# EAGLE design working (EAGLE 9.6.0)
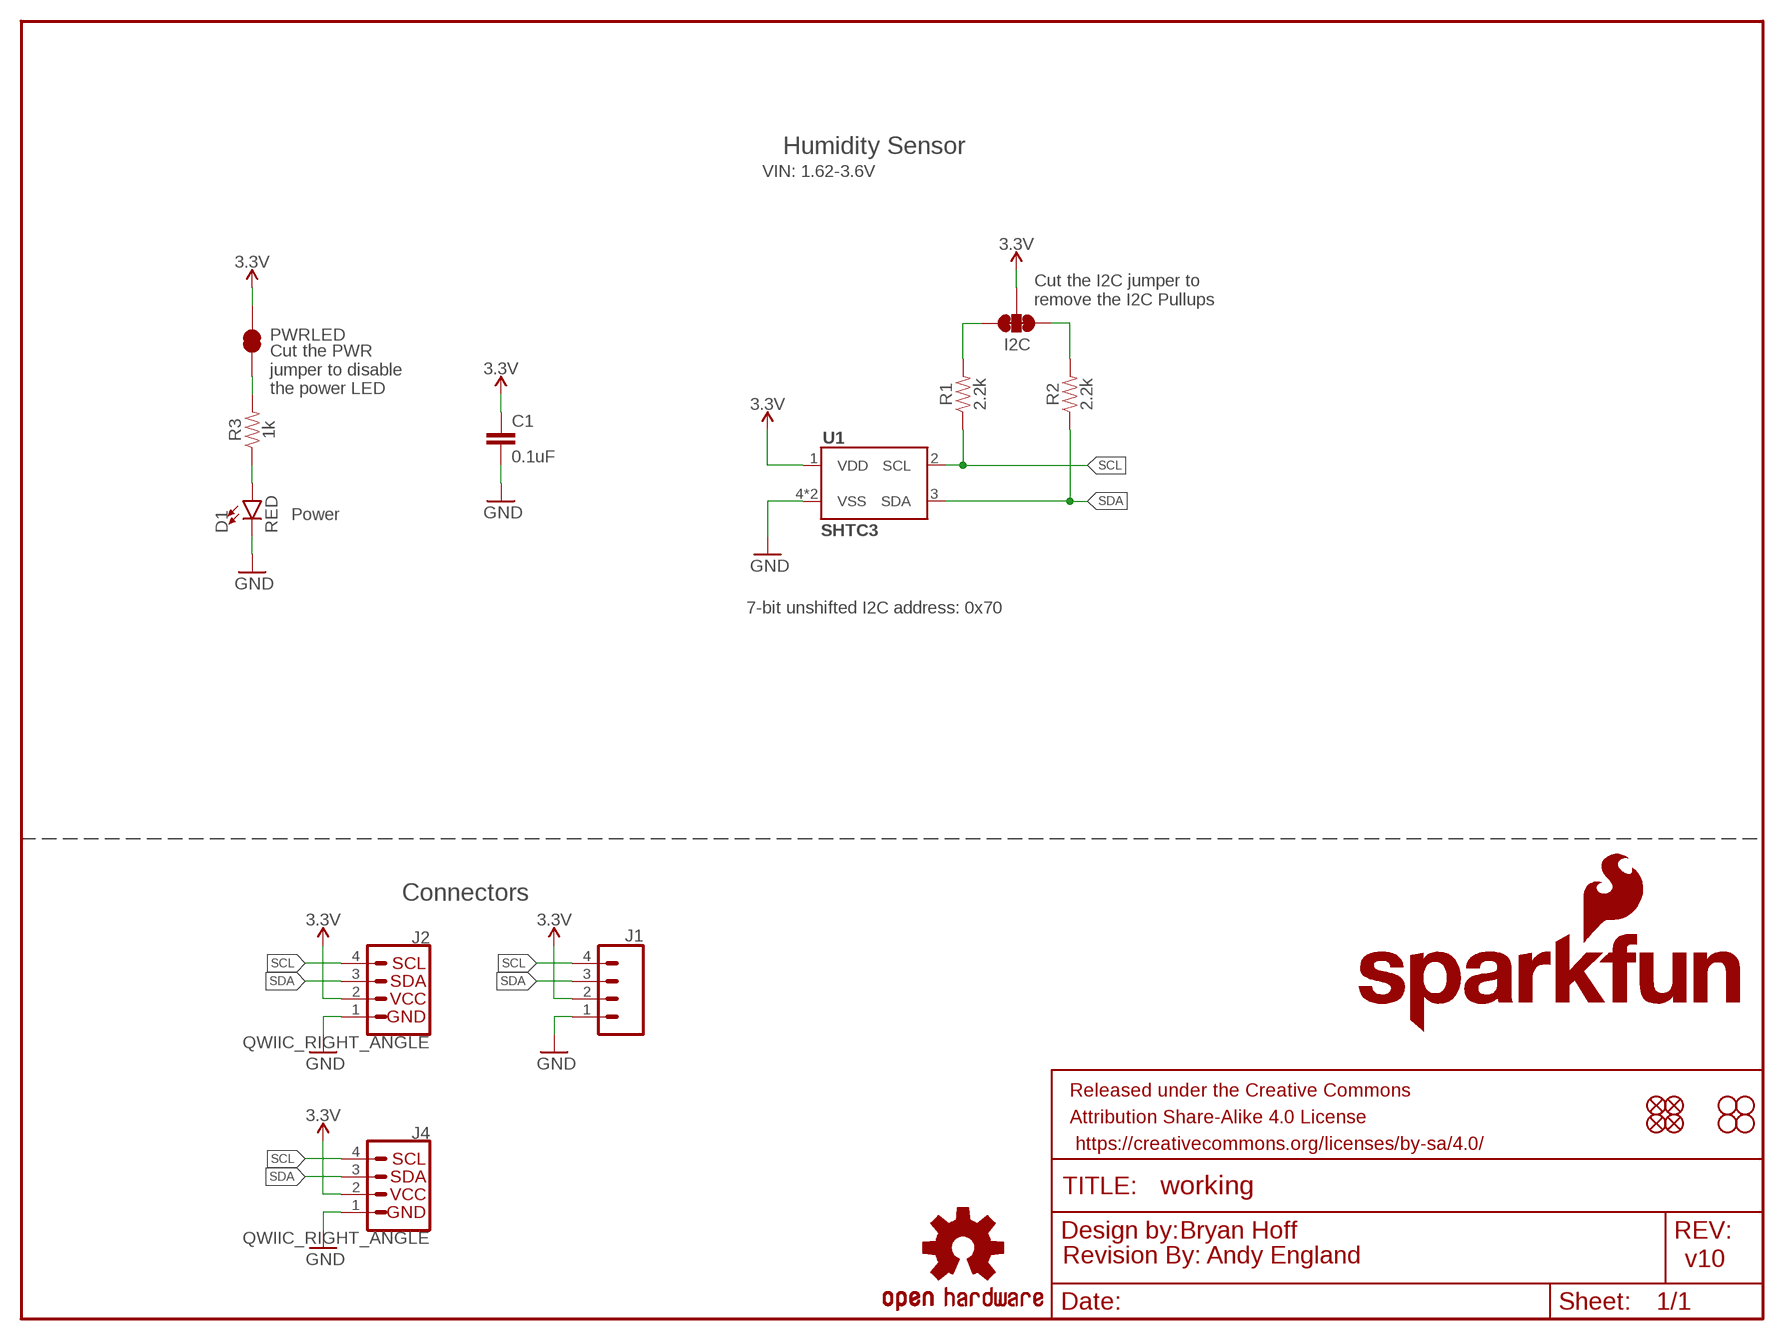
[diagram p0: schematic, sheet 1]

## Parts
C1  0.1uF  0.1UF-0603-25V-(+80/-20%)  [0603]
D1  RED  LED-RED0603  [LED-0603]
FRAME1  FRAME-LETTER  [CREATIVE_COMMONS]
I2C  JUMPER-SMT_3_2-NC_TRACE_SILK  [SMT-JUMPER_3_2-NC_TRACE_SILK]
J1  CONN_041X04_NO_SILK  [1X04_NO_SILK]
J2  QWIIC_RIGHT_ANGLE  QWIIC_CONNECTORJS-1MM  [JST04_1MM_RA]
J4  QWIIC_RIGHT_ANGLE  QWIIC_CONNECTORJS-1MM  [JST04_1MM_RA]
JP1  FIDUCIALUFIDUCIAL  [MICRO-FIDUCIAL]
JP2  FIDUCIALUFIDUCIAL  [MICRO-FIDUCIAL]
JP3  STAND-OFF  [STAND-OFF]
JP4  STAND-OFF  [STAND-OFF]
JP5  FIDUCIALUFIDUCIAL  [MICRO-FIDUCIAL]
JP6  FIDUCIALUFIDUCIAL  [MICRO-FIDUCIAL]
JP7  STAND-OFF  [STAND-OFF]
JP8  STAND-OFF  [STAND-OFF]
LOGO1  OSHW-LOGOMINI  [OSHW-LOGO-MINI]
LOGO2  SFE_LOGO_NAME_FLAME.1_INCH  [SFE_LOGO_NAME_FLAME_.1]
LOGO3  SFE_LOGO_NAME_FLAME.1_INCH  [SFE_LOGO_NAME_FLAME_.1]
LOGO4  REVISION  [REVISION]
PWRLED  JUMPER-SMT_2_NC_TRACE_SILK  [SMT-JUMPER_2_NC_TRACE_SILK]
R1  2.2k  2.2KOHM-0603-1/10W-1%  [0603]
R2  2.2k  2.2KOHM-0603-1/10W-1%  [0603]
R3  1k  1KOHM-0603-1/10W-1%  [0603]
U1  SHTC3  [SHTC3]

## Nets
3.3V: C1.1 I2C.2 J1.2 J2.2 J4.2 PWRLED.2 U1.1(VDD)
GND: C1.2 D1.C J1.1 J2.1 J4.1 U1.4(VSS) U1.5(VSS)
N$1: I2C.3 R1.2
N$2: I2C.1 R2.2
N$3: D1.A R3.1
N$4: PWRLED.1 R3.2
SCL: J1.4 J2.4 J4.4 R1.1 U1.2(SCL)
SDA: J1.3 J2.3 J4.3 R2.1 U1.3(SDA)

## Notes on the sheet
- Humidity Sensor
- VIN: 1.62-3.6V
- Cut the I2C jumper to 
  remove the I2C Pullups
- Cut the PWR
  jumper to disable
  the power LED
- Power
- 7-bit unshifted I2C address: 0x70
- Connectors
- Bryan Hoff
- Andy England | v10

## Library data of the parts
C1 = SparkFun-Capacitors:0.1UF: 0.1µF ceramic capacitors A capacitor is a passive two-terminal electrical component used to store electrical energy temporarily in an electric field.; PROD_ID: CAP-00810
D1 = SparkFun-LED:LED-RED: Red SMD LED Used in manufacturing of most products at SparkFun Packages: 0603 - SMD 0603 package [Product Link] <http://docs.avagotech.com/docs/AV02-0551EN> 0603 SMART - SMD 0603 SMART package ( more efficient and expensive)[Product Link] <http://www.osram-os.com/Graphics/XPic2/00077099_0.pdf> 1206 - SMD1206 package [Product Link] <https://www.sparkfun.com/datasheets/DevTools/LilyPad/Q150OVS4.pdff> SparkFun Products: Pro Mini 328 -5V <https://www.sparkfun.com/products/821> RedBoard <https://www.sparkfun.com/products/12757> IOIO-OTG <https://www.sparkfun.com/products/13613>; PROD_ID: DIO-00819
FRAME1 = SparkFun-Aesthetics:FRAME-LETTER: Schematic Frame - Letter Standard 8.5x11 US Letter frame
I2C = SparkFun-Jumpers:JUMPER-SMT_3_2-NC_TRACE: Normally closed trace jumper (2 of 2 connections) This jumper has a trace between all three pads so they are normally closed (NC). Use a razor knife to open the connection(s). For best results follow the IPC guidelines for cutting traces: Cutout at least 0.063 mm (0.005 in). Remove all loose material to clean up the cut area. Seal the cut with an approved epoxy. Reapply solder to reclose the connection(s).
J1 = SparkFun-Connectors:CONN_04: Multi connection point. Often used as Generic Header-pin footprint for 0.1 inch spaced/style header connections On any of the 0.1 inch spaced packages, you can populate with these: Break Away Headers - Straight <https://www.sparkfun.com/products/116> (PRT-00116) Break Away Male Headers - Right Angle <https://www.sparkfun.com/products/553> (PRT-00553) Female Headers <https://www.sparkfun.com/products/115> (PRT-00115) Break Away Headers - Machine Pin <https://www.sparkfun.com/products/117> (PRT-00117) Break Away Female Headers - Swiss Machine Pin <https://www.sparkfun.com/products/743> (PRT-00743) For SCREWTERMINALS and SPRING TERMINALS visit here: Screw Terimnals on SparkFun.com <https://www.sparkfun.com/search/results?term=Screw+Terminals> (5mm/3.5mm/2.54mm spacing) This device is also useful as a general connection point to wire up your design to another part of your project. Our various solder wires solder well into these plated through hole pads. Hook-Up Wire - Assortment (Stranded, 22 AWG) <https://www.sparkfun.com/products/11375> (PRT-11375) Hook-Up Wire - Assortment (Solid Core, 22 AWG) <https://www.sparkfun.com/products/11367> (PRT-11367) View the entire wire category on our website here <https://www.sparkfun.com/categories/141> Special notes: Molex polarized connector foot print use with SKU : PRT-08231 with associated crimp pins and housings. 1MM SMD Version SKU: PRT-10208; PROD_ID: CONN-09696
J2 J4 = SparkFun-Connectors:QWIIC_CONNECTOR: SparkFun I2C Standard Qwiic Connector An SMD 1mm pitch JST connector makes it easy and quick (get it? Qwiic?) to connect I2C devices to each other. The Qwiic system <http://www.sparkfun.com/qwiic> enables fast and solderless connection between popular platforms and various sensors and actuators. We carry 200mm <https://www.sparkfun.com/products/14204>, 100mm <https://www.sparkfun.com/products/14205>, 50mm <https://www.sparkfun.com/products/14206>, and breadboard friendly <https://www.sparkfun.com/products/14207> Qwiic cables. We also offer 10 pcs strips <https://www.sparkfun.com/products/14323> the SMD connectors.; PROD_ID: CONN-13694
JP1 JP2 JP5 JP6 = SparkFun:FIDUCIAL: Fiducial Alignment Points Various fiducial points for machine vision alignment.
JP3 JP4 JP7 JP8 = SparkFun:STAND-OFF: Stand Off This is the mechanical footprint for a #4 phillips button head screw. Use the keepout ring to avoid running the screw head into surrounding components. SKU : PRT-00447
LOGO1 = SparkFun-Aesthetics:OSHW-LOGO: Open-Source Hardware (OSHW) Logo This logo indicates the piece of hardware it is found on incorporates a OSHW license and/or adheres to the definition of open source hardware found here: http://freedomdefined.org/OSHW
LOGO2 LOGO3 = SparkFun-Aesthetics:SFE_LOGO_NAME_FLAME: SparkFun Font Logo w/ Flame This is the SparkFun full logo. The logo on the schematic will always be the same size; the package variant is the height of the flame part of the logo. Default layer for the logo on the board is tSilk.
LOGO4 = SparkFun-Aesthetics:REVISION: "Revision By" Text Preceding text for revisor documentation. Includes schematic text on "symbols" layer, and board text on tDoc.
PWRLED = SparkFun-Jumpers:JUMPER-SMT_2_NC_TRACE: Normally closed trace jumper This jumper has a trace between two pads so it's normally closed (NC). Use a razor knife to open the connection. For best results follow the IPC guidelines for cutting traces: Cutout at least 0.063 mm (0.005 in). Remove all loose material to clean up the cut area. Seal the cut with an approved epoxy. Reapply solder to reclose the connection.
R1 R2 = SparkFun-Resistors:2.2KOHM: 2.2kΩ resistor A resistor is a passive two-terminal electrical component that implements electrical resistance as a circuit element. Resistors act to reduce current flow, and, at the same time, act to lower voltage levels within circuits. - Wikipedia; PROD_ID: RES-08272
R3 = SparkFun-Resistors:1KOHM: 1kΩ resistor A resistor is a passive two-terminal electrical component that implements electrical resistance as a circuit element. Resistors act to reduce current flow, and, at the same time, act to lower voltage levels within circuits. - Wikipedia; PROD_ID: RES-07856
U1 = SparkFun-Sensors:SHTC3: Sensirion SHTC3 Humidity Sensor The SHTC3 is a digital humidity and temperature sensor designed especially for battery-driven high-volume consumer electronics applications.; PROD_ID: IC-14840

## Net classes
1 power: width 0.203 mm

## Board
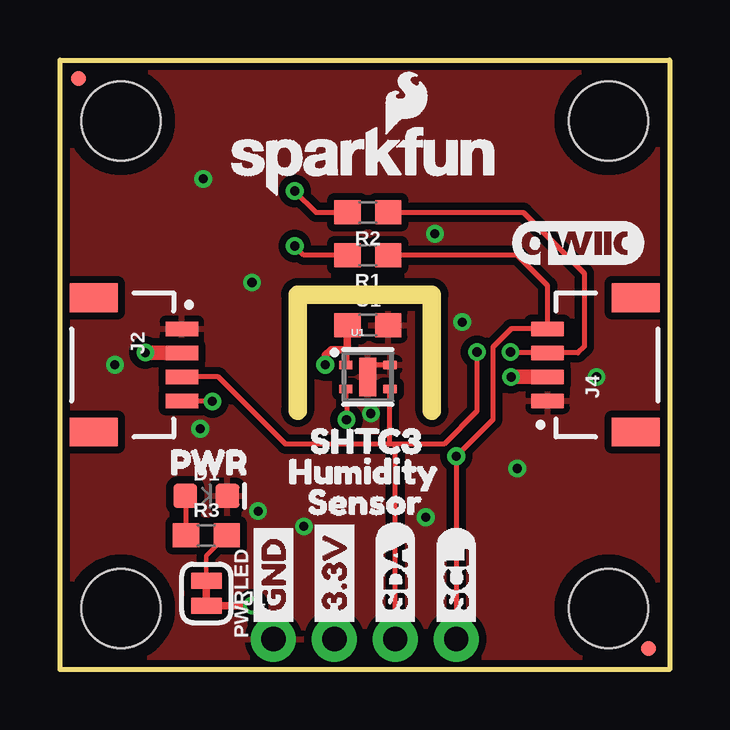
[diagram p1: board, top side]
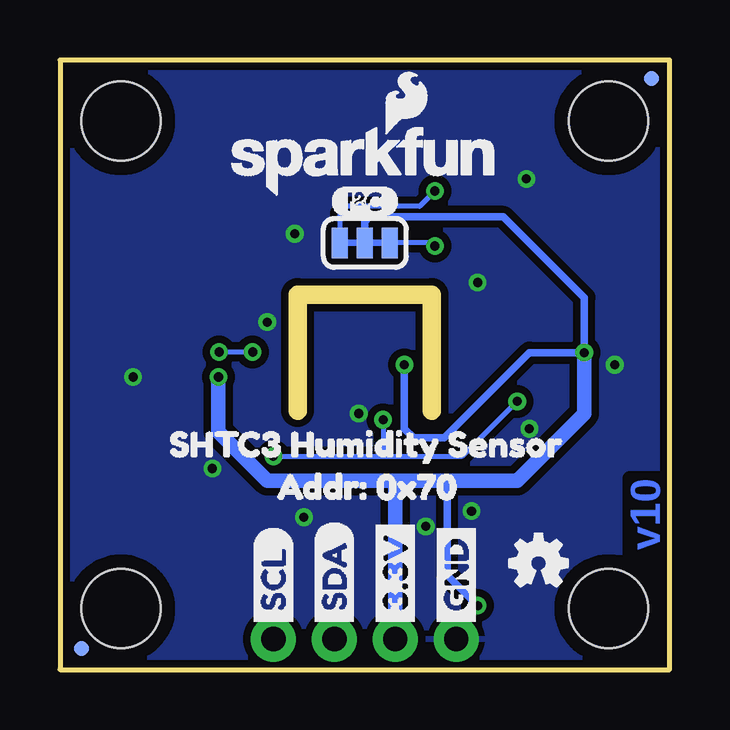
[diagram p2: board, bottom side, seen from below]

Size 25.4 x 25.4 mm. Coordinates in mm from the lower left corner, seen from the top.
Outline: 0,0 0,25.4 25.4,25.4 25.4,0 0,0
Copper layers (1*16): Top 0.035mm / dielectric 1.5mm / Bottom 0.035mm
Design rules "SparkFun-2-layer-TIGHT": minimum track width 7mil, minimum drill 15mil, track to track 7mil, track to pad 7mil, pad to pad 7mil, via to via 7mil, smd to smd 7mil, copper to edge 7mil, drill to drill 7mil, minimum pad ring 7mil, minimum via ring 7mil, stop-mask expansion 4mil, vias tented up to drill 25mil, thermal gap 10mil
tRestrict: 3 lines
bRestrict: 3 lines
Milling: 3 lines

### Footprints (pad centres in the part's own frame; a part is rotated, then mirrored left to right if it is on the bottom)
0603 = smd 1.1 x 1: 1 -0.85,0; 2 0.85,0
LED-0603 = smd 1 x 1: A -0.877,0; C 0.877,0
SMT-JUMPER_3_2-NC_TRACE_SILK = smd 0.66 x 1.27: 1 -1.041,0; 2 0,0; 3 1.041,0
1X04_NO_SILK = drill 1.016 pad 1.88: 1 0,0; 2 2.54,0; 3 5.08,0; 4 7.62,0
JST04_1MM_RA = smd 0.6 x 1.35: 1 -1.5,0; 2 -0.5,0; 3 0.5,0; 4 1.5,0 | smd 1.2 x 2: NC1 2.8,-3.675; NC2 -2.8,-3.675
MICRO-FIDUCIAL = smd 0.635 x 0.635: 1 0,0
STAND-OFF = hole 3.302: 0,0
SMT-JUMPER_2_NC_TRACE_SILK = smd 0.66 x 1.27: 1 -0.521,0; 2 0.521,0
SHTC3 = smd 0.55 x 0.35: 1 -0.925,0.5; 2 -0.925,-0.5; 3 0.925,-0.5; 4 0.925,0.5 | smd 0.7 x 1.6: 5 0,0

### Placement (x,y rotation side)
C1  12.83,14.35 0 top
D1  6.1,7.24 0 top
FRAME1  -12.7,-19.05 0 top  (outside the outline)
I2C  12.7,17.78 0 bottom
J1  8.89,1.27 0 top
J2  5.08,12.7 270 top
J4  20.32,12.7 90 top
JP1  0.76,24.64 0 bottom
JP2  24.51,0.89 0 top
JP3  2.54,22.86 0 top
JP4  22.86,22.86 0 top
JP5  24.51,0.89 0 bottom
JP6  0.76,24.64 0 top
JP7  2.54,2.54 0 top
JP8  22.86,2.54 0 top
LOGO1  5.46,4.45 0 bottom
LOGO2  12.7,21.21 0 top
LOGO3  12.7,21.21 0 bottom
LOGO4  -1.27,-21.59 0 top  (outside the outline)
PWRLED  6.1,3.17 270 top
R1  12.83,17.27 180 top
R2  12.83,19.05 180 top
R3  6.1,5.59 0 top
U1  12.83,12.19 0 top
U$1  [ADDR#_0X700]  17.27,7.62 0 bottom
U$2  [PWR_TO]  3.68,8.64 0 top
U$3  [GND1]  8.89,1.52 90 bottom
U$4  [3#3V2]  11.43,1.52 90 bottom
U$5  [SDA8]  13.97,1.52 90 bottom
U$6  [SCL9]  16.51,1.52 90 bottom
U$7  [SHTC3_HUMIDITY_SENSOR2]  21.72,9.4 0 bottom
U$8  [_SHTC31]  9.14,9.53 0 top
U$9  [I_SUPER2_C-()-03]  14.12,19.51 0 bottom
U$10  [HUMIDITY2]  8.64,8.26 0 top
U$11  [QWIIC_5.5MM]  21.59,17.78 0 top
U$12  [SENSOR0]  9.4,6.99 0 top
U$21  [3#3V2]  11.43,1.52 90 top
U$22  [GND1]  8.89,1.52 90 top
U$26  [SCL9]  16.51,1.52 90 top
U$27  [SDA8]  13.97,1.52 90 top

### Tracks (layer width: path | path; a pad name or v marks a point on that pad's centre or on a via)
3.3V  (via drill 0.38)
  Top 0.305: J4.2 | J2.2 | v11.05,12.7 v11.06,12.69 11.06,13.09 11.3,13.34 11.91,13.34 | C1.1 11.98,13.4 11.91,13.34 | 11.91,13.34 11.9,13.33 U1.1 | v8,2.67 7.75,2.67 7.73,2.65 PWRLED.2
  Top 0.61: v18.8,12.19 J4.2 | v3.56,13.21 J2.2
  Bottom 0.305: v11.05,12.7 11.05,10.03 10.67,9.65 9.4,9.65 5.84,13.21 v3.56,13.21 3.56,15.49 6.92,18.86 12.51,18.86 12.7,18.67 I2C.2 | v8,2.67 9.27,3.94 9.27,7.87
  Bottom 0.61: 11.43,7.87 9.27,7.87 6.35,7.87 3.56,10.67 v3.56,13.21 | 11.43,7.87 16.76,7.87 18.8,9.91 v18.8,12.19 | 11.43,7.87 J1.2
GND  (via drill 0.38)
  Top 0.178: U1.4 12.71,12.69 12.7,12.7 12.7,12.32 U1.5
  other vias: 15.24,6.35 19.05,8.38 15.62,18.16 2.29,12.7 16.76,14.48 5.97,20.45 5.84,10.03 22.35,12.19 8.26,6.6 8,16.13 12.95,10.67 10.16,5.97
  pour Bottom (isolate 0.305): 0,0 0,25.4 25.4,25.4 25.4,0
  pour Top (isolate 0.305): 0,0 0,25.4 25.4,25.4 25.4,0
N$1  (via drill 0.38)
  Top 0.203: R1.2 10.16,17.27 v9.78,17.65
  Bottom 0.203: v9.78,17.65 9.91,17.78 I2C.3
N$2  (via drill 0.38)
  Top 0.203: R2.2 10.67,19.05 v9.78,19.94
  Bottom 0.203: v9.78,19.94 10.41,19.3 13.46,19.3 13.74,19.02 I2C.1
N$3
  Top 0.203: 5.25,7.21 R3.1
  Top 0.254: D1.A 5.25,7.21
N$4
  Top 0.178: PWRLED.1 6.1,4.74 R3.2
SCL  (via drill 0.38)
  Top 0.203: v6.35,11.18 5.1,11.18 | U1.2 11.9,11.09 11.94,11.05 v11.94,10.41 | R1.1 19.05,17.27 20.32,16 J4.4 18.8,14.2 18.03,13.44 18.03,10.41 v16.51,8.89 J1.4
  Top 0.254: 5.1,11.18 J2.4
  Bottom 0.203: v6.35,11.18 8.64,8.89 11.94,8.89 | v16.51,8.89 11.94,8.89 | v11.94,10.41 11.94,8.89
SDA  (via drill 0.38)
  Top 0.203: J2.3 6.6,12.19 9.4,9.4 13.72,9.4 | v17.37,13.23 17.37,10.77 16,9.4 13.97,9.4 | 13.97,9.4 13.72,9.4 | U1.3 13.72,11.66 13.72,9.4 | R2.1 19.3,19.05 21.84,16.51 21.84,13.46 21.58,13.2 J4.3 18.8,13.2 v18.77,13.23 | J1.3 13.97,9.4
  Top 0.254: J2.3
  Bottom 0.203: v18.77,13.23 v17.37,13.23

### Text on the board
Bottom: v10
Measures: Dimensions in inches
tDocu: Bryan Hoff | Andy England